# EAGLE schematic resistance_measuring_board (EAGLE 9.6.2)
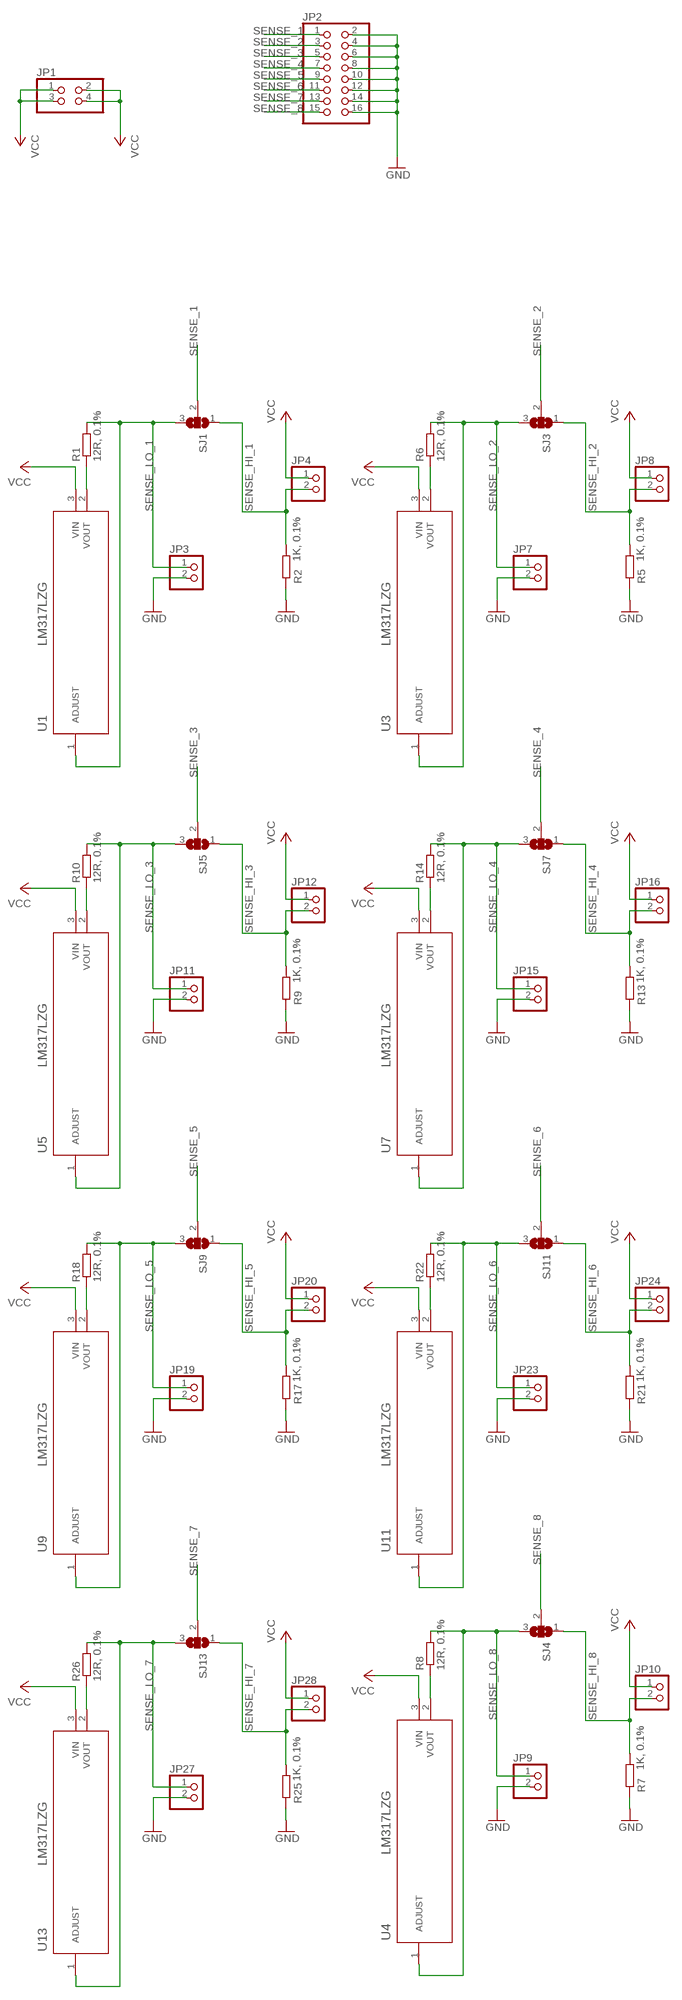
[diagram p0: schematic, sheet 1]

## Parts
JP1  PINHD-2X2/90  [2X02/90]
JP2  PINHD-2X8/90  [2X08/90]
JP3  PINHD-1X2  [1X02]
JP4  PINHD-1X2  [1X02]
JP7  PINHD-1X2  [1X02]
JP8  PINHD-1X2  [1X02]
JP9  PINHD-1X2  [1X02]
JP10  PINHD-1X2  [1X02]
JP11  PINHD-1X2  [1X02]
JP12  PINHD-1X2  [1X02]
JP15  PINHD-1X2  [1X02]
JP16  PINHD-1X2  [1X02]
JP19  PINHD-1X2  [1X02]
JP20  PINHD-1X2  [1X02]
JP23  PINHD-1X2  [1X02]
JP24  PINHD-1X2  [1X02]
JP27  PINHD-1X2  [1X02]
JP28  PINHD-1X2  [1X02]
R1  12R, 0.1%  R-EU_R0603  [R0603]
R2  1K, 0.1%  R-EU_R1206  [R1206]
R5  1K, 0.1%  R-EU_R1206  [R1206]
R6  12R, 0.1%  R-EU_R0603  [R0603]
R7  1K, 0.1%  R-EU_R1206  [R1206]
R8  12R, 0.1%  R-EU_R0603  [R0603]
R9  1K, 0.1%  R-EU_R1206  [R1206]
R10  12R, 0.1%  R-EU_R0603  [R0603]
R13  1K, 0.1%  R-EU_R1206  [R1206]
R14  12R, 0.1%  R-EU_R0603  [R0603]
R17  1K, 0.1%  R-EU_R1206  [R1206]
R18  12R, 0.1%  R-EU_R0603  [R0603]
R21  1K, 0.1%  R-EU_R1206  [R1206]
R22  12R, 0.1%  R-EU_R0603  [R0603]
R25  1K, 0.1%  R-EU_R1206  [R1206]
R26  12R, 0.1%  R-EU_R0603  [R0603]
SJ1  SJ2W  [SJ_2]
SJ3  SJ2W  [SJ_2]
SJ4  SJ2W  [SJ_2]
SJ5  SJ2W  [SJ_2]
SJ7  SJ2W  [SJ_2]
SJ9  SJ2W  [SJ_2]
SJ11  SJ2W  [SJ_2]
SJ13  SJ2W  [SJ_2]
U1  LM317LZG  [TO-92_ONS]
U3  LM317LZG  [TO-92_ONS]
U4  LM317LZG  [TO-92_ONS]
U5  LM317LZG  [TO-92_ONS]
U7  LM317LZG  [TO-92_ONS]
U9  LM317LZG  [TO-92_ONS]
U11  LM317LZG  [TO-92_ONS]
U13  LM317LZG  [TO-92_ONS]

## Nets
GND: JP2.2 JP2.4 JP2.6 JP2.8 JP2.10 JP2.12 JP2.14 JP2.16 JP3.2 JP7.2 JP9.2 JP11.2 JP15.2 JP19.2 JP23.2 JP27.2 R2.1 R5.1 R7.1 R9.1 R13.1 R17.1 R21.1 R25.1
N$2: R6.1 U3.2(VOUT)
N$3: R8.1 U4.2(VOUT)
N$4: R10.1 U5.2(VOUT)
N$6: R14.1 U7.2(VOUT)
N$8: R18.1 U9.2(VOUT)
N$10: R22.1 U11.2(VOUT)
N$12: R26.1 U13.2(VOUT)
N$13: R1.1 U1.2(VOUT)
SENSE_1: JP2.1 SJ1.2
SENSE_2: JP2.3 SJ3.2
SENSE_3: JP2.5 SJ5.2
SENSE_4: JP2.7 SJ7.2
SENSE_5: JP2.9 SJ9.2
SENSE_6: JP2.11 SJ11.2
SENSE_7: JP2.13 SJ13.2
SENSE_8: JP2.15 SJ4.2
SENSE_HI_1: JP4.2 R2.2 SJ1.1
SENSE_HI_2: JP8.2 R5.2 SJ3.1
SENSE_HI_3: JP12.2 R9.2 SJ5.1
SENSE_HI_4: JP16.2 R13.2 SJ7.1
SENSE_HI_5: JP20.2 R17.2 SJ9.1
SENSE_HI_6: JP24.2 R21.2 SJ11.1
SENSE_HI_7: JP28.2 R25.2 SJ13.1
SENSE_HI_8: JP10.2 R7.2 SJ4.1
SENSE_LO_1: JP3.1 R1.2 SJ1.3 U1.1(ADJUST)
SENSE_LO_2: JP7.1 R6.2 SJ3.3 U3.1(ADJUST)
SENSE_LO_3: JP11.1 R10.2 SJ5.3 U5.1(ADJUST)
SENSE_LO_4: JP15.1 R14.2 SJ7.3 U7.1(ADJUST)
SENSE_LO_5: JP19.1 R18.2 SJ9.3 U9.1(ADJUST)
SENSE_LO_6: JP23.1 R22.2 SJ11.3 U11.1(ADJUST)
SENSE_LO_7: JP27.1 R26.2 SJ13.3 U13.1(ADJUST)
SENSE_LO_8: JP9.1 R8.2 SJ4.3 U4.1(ADJUST)
VCC: JP1.1 JP1.2 JP1.3 JP1.4 JP4.1 JP8.1 JP10.1 JP12.1 JP16.1 JP20.1 JP24.1 JP28.1 U1.3(VIN) U3.3(VIN) U4.3(VIN) U5.3(VIN) U7.3(VIN) U9.3(VIN) U11.3(VIN) U13.3(VIN)

## Library data of the parts
JP1 = pinhead:PINHD-2X2: PIN HEADER
JP2 = pinhead:PINHD-2X8: PIN HEADER
JP3 JP4 JP7-JP12 JP15 JP16 JP19 JP20 JP23 JP24 JP27 JP28 = pinhead:PINHD-1X2: PIN HEADER
R1 R2 R5-R10 R13 R14 R17 R18 R21 R22 R25 R26 = resistor:R-EU_: RESISTOR, European symbol
SJ1 SJ3-SJ5 SJ7 SJ9 SJ11 SJ13 = jumper:SJ2W: SMD solder JUMPER
U1 U3-U5 U7 U9 U11 U13 = LM317LZG:LM317LZG; BUILT_BY: EMA_UL_Team; MANUFACTURER_PART_NUMBER: LM317LZG; SOURCELIBRARY: ON_Semi_2010-01-01; VENDOR: ON Semiconductor